# EasyEDA schematic SCH_ADC-To-Multiple-Switches.json
TITLE: Single ADC Pin to Multiple Switches; REV: 1.0; Date: 2026-03-21; Sheet: 1/1; Drawn By: asd12; Company: Your Company
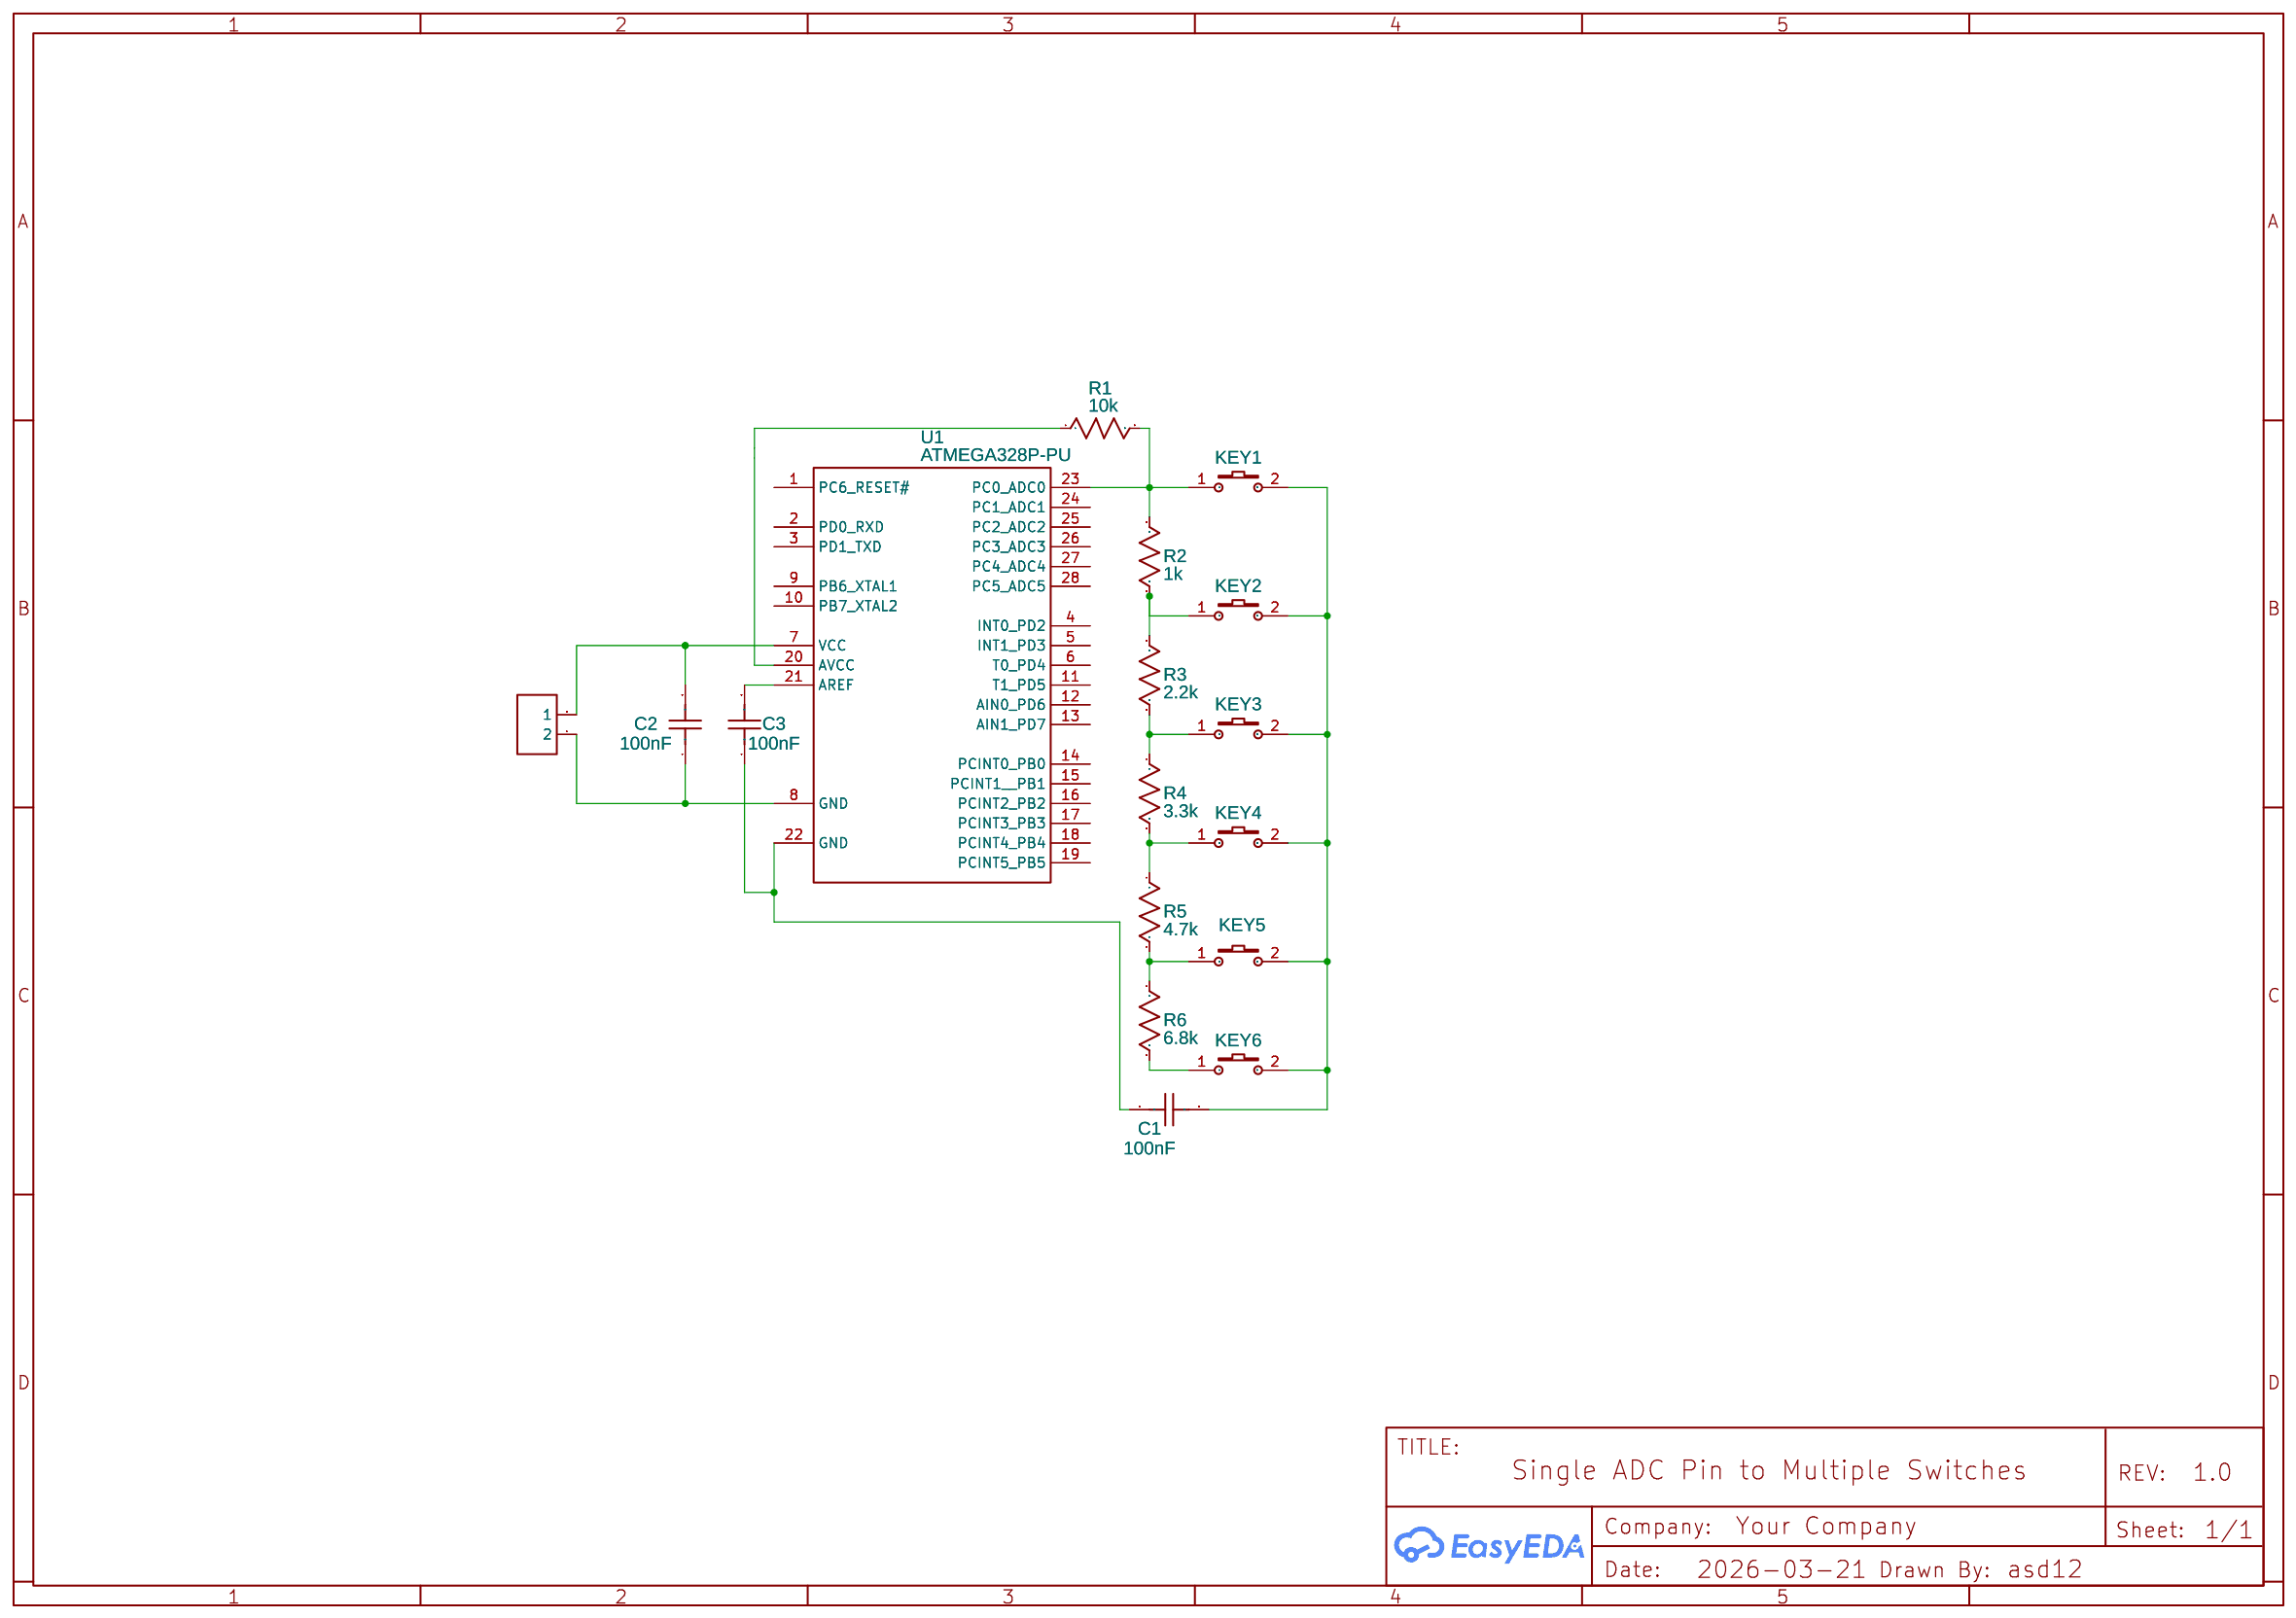
[diagram p0: schematic sheet]

## Parts
C1  100nF  [C0603]
C2  100nF  [C0603]
C3  100nF  [C0603]
KEY1  K2-3.6×6.1_SMD  [KEY-SMD_2P-L6.2-W3.6-LS8.0]
KEY2  K2-3.6×6.1_SMD  [KEY-SMD_2P-L6.2-W3.6-LS8.0]
KEY3  K2-3.6×6.1_SMD  [KEY-SMD_2P-L6.2-W3.6-LS8.0]
KEY4  K2-3.6×6.1_SMD  [KEY-SMD_2P-L6.2-W3.6-LS8.0]
KEY5  K2-3.6×6.1_SMD  [KEY-SMD_2P-L6.2-W3.6-LS8.0]
KEY6  K2-3.6×6.1_SMD  [KEY-SMD_2P-L6.2-W3.6-LS8.0]
P1  CONN-TH_2P-P5.00  [CONN-TH_2P-P5.00]
R1  10k  [R0603]
R2  1k  [R0603]
R3  2.2k  [R0603]
R4  3.3k  [R0603]
R5  4.7k  [R0603]
R6  6.8k  [R0603]
U1  ATMEGA328P-PU  [DIP-28_L34.6-W7.3-P2.54-LS10.2-BL]

## Library data of the parts
C1-C3 = C_0603_US: Contributor: LCEDA_Lib
KEY1-KEY6 = K2-3.6×6.1_SMD: Supplier Part: C118141; Supplier: LCSC; Manufacturer Part: K2-1107ST-A4SW-06; Contributor: LCEDA_Lib; 制造商: 韩国韩荣
P1 = CONN-TH_2P-P5.00: Supplier: LCSC; Contributor: LCEDA_Lib
R1-R6 = R_0603_US: Contributor: LCEDA_Lib
U1 = ATMEGA328P-PU: sourceId: Oic6oiASL; Contributor: LCSC; Supplier: LCSC; Manufacturer: MICROCHIP(美国微芯); Supplier Part: C33901; JLCPCB Part Class: Extended Part

## Nets
Net-(C1-1): C1.1 C3.1 U1.22(GND)
Net-(C1-2): C1.2 KEY1.2 KEY2.2 KEY3.2 KEY4.2 KEY5.2 KEY6.2
Net-(C2-1): C2.1 P1.1(2) U1.8(GND)
Net-(C2-2): C2.2 P1.2(1) U1.7(VCC)
Net-(C3-2): C3.2 U1.21(AREF)
Net-(KEY1-1): KEY1.1 R1.2 R2.1 U1.23(PC0 ADC0)
Net-(KEY2-1): KEY2.1 R2.2 R3.1
Net-(KEY3-1): KEY3.1 R3.2 R4.1
Net-(KEY4-1): KEY4.1 R4.2 R5.1
Net-(KEY5-1): KEY5.1 R5.2 R6.1
Net-(KEY6-1): KEY6.1 R6.2
Net-(R1-1): R1.1 U1.20(AVCC)

Not connected (* = marked no-connect by the designer): U1 1(PC6 RESET#) 2(PD0 RXD) 3(PD1 TXD) 4(INT0 PD2) 5(INT1 PD3) 6(T0 PD4) 9(PB6 XTAL1) 10(PB7 XTAL2) 11(T1 PD5) 12(AIN0 PD6) 13(AIN1 PD7) 14(PCINT0 PB0) 15(PCINT1  PB1) 16(PCINT2 PB2) 17(PCINT3 PB3) 18(PCINT4 PB4) 19(PCINT5 PB5) 24(PC1 ADC1) 25(PC2 ADC2) 26(PC3 ADC3) 27(PC4 ADC4) 28(PC5 ADC5)
